# Altium schematic sheet 03-Ethernet.SchDoc: Ethernet Connection
size A4; Engineer: Juan M Garin; Organization: ESO; Address1: Juan M Garin; DocumentNumber: 3; Revision: 1.0; SheetNumber: 3; SheetTotal: 6
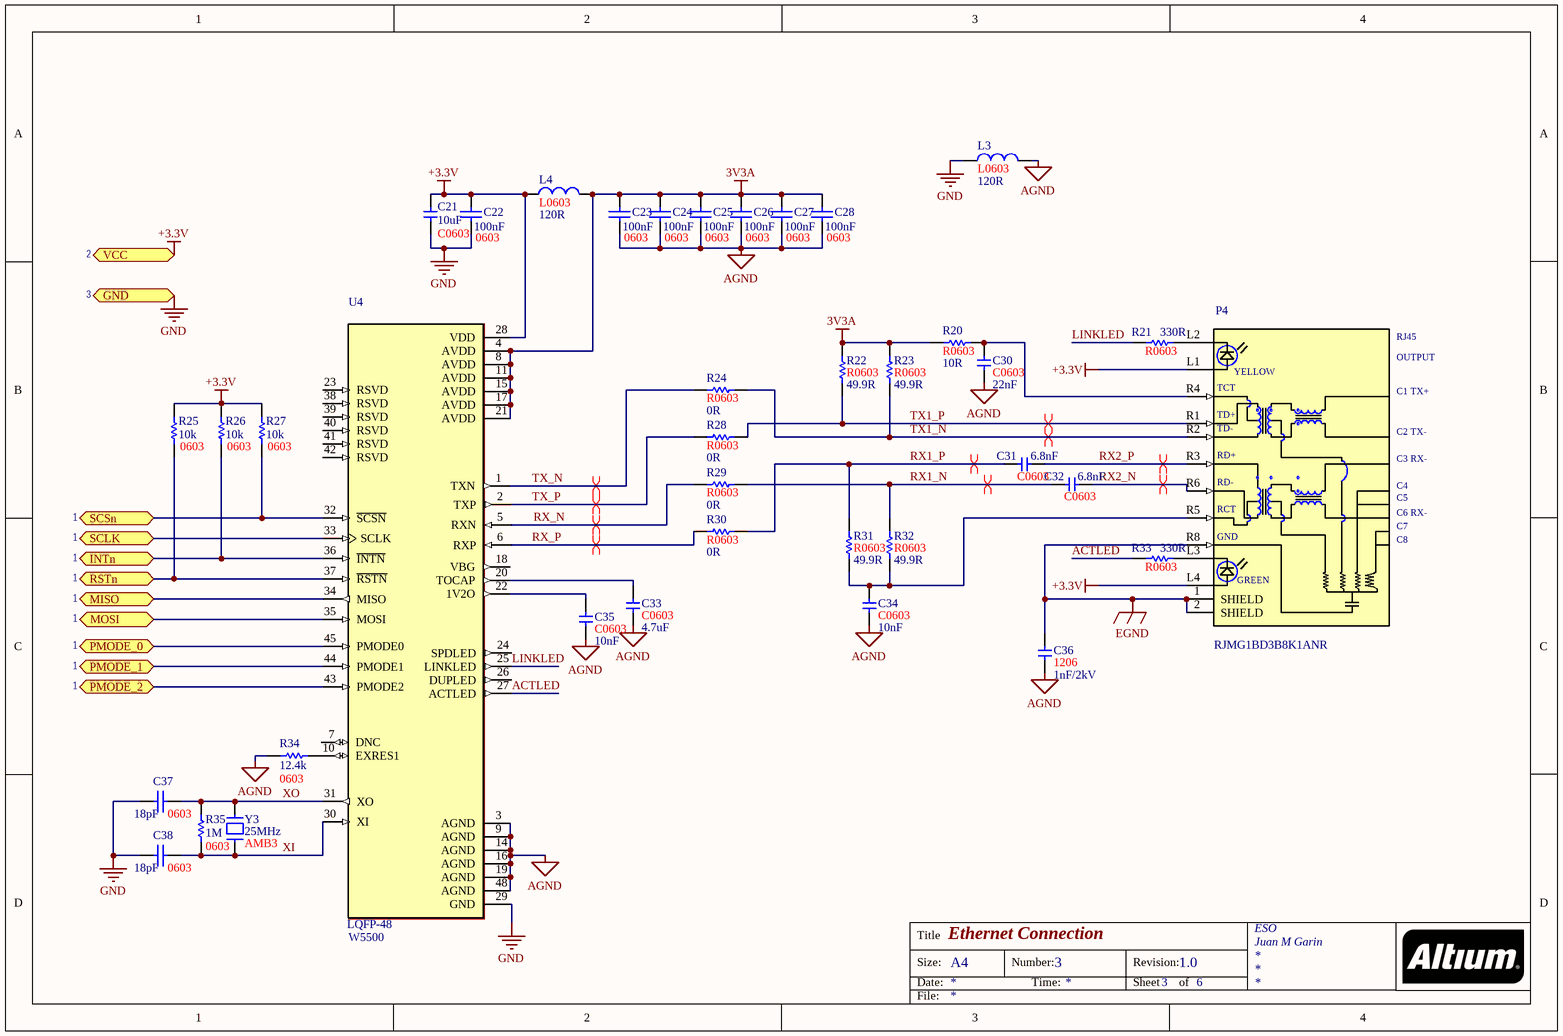
[diagram p0: 03-Ethernet.SchDoc]

## Parts
C21  10uF  [C0603]
C22  100nF  PackageReference: 0603  [C0603]
C23  100nF  PackageReference: 0603  [C0603]
C24  100nF  PackageReference: 0603  [C0603]
C25  100nF  PackageReference: 0603  [C0603]
C26  100nF  PackageReference: 0603  [C0603]
C27  100nF  PackageReference: 0603  [C0603]
C28  100nF  PackageReference: 0603  [C0603]
C30  22nF  [C0603]
C31  6.8nF  [C0603]
C32  6.8nF  [C0603]
C33  4.7uF  [C0603]
C34  10nF  [C0603]
C35  10nF  [C0603]
C36  PackageReference: 1206  [R1206]  (hidden comment: 1nF/2kV)
C37  18pF  PackageReference: 0603  [C0603]
C38  18pF  PackageReference: 0603  [C0603]
L3  120R  [L0603]
L4  120R  [L0603]
P4  RJMG1BD3B8K1ANR  [CONN_RJMG1BD3B8K1ANR_RJMG1BD3B8K1ANR(Primary)]
R20  10R  [R0603]
R21  330R  [R0603]
R22  49.9R  [R0603]
R23  49.9R  [R0603]
R24  0R  [R0603]
R25  10k  PackageReference: 0603  [R0603]
R26  10k  PackageReference: 0603  [R0603]
R27  10k  PackageReference: 0603  [R0603]
R28  0R  [R0603]
R29  0R  [R0603]
R30  0R  [R0603]
R31  49.9R  [R0603]
R32  49.9R  [R0603]
R33  330R  [R0603]
R34  12.4k  PackageReference: 0603  [R0603]
R35  1M  PackageReference: 0603  [R0603]
U4  W5500  PackageReference: LQFP-48  [QFP50P700X700X160-48N]
Y3  25MHz  PackageReference: AMB3  [CRYSTAL-AMB3_5X3.2_1.3]

## Ports
GND, INTn, MISO, MOSI, PMODE_0, PMODE_1, PMODE_2, RSTn, SCLK, SCSn, VCC

## Nets
3V3A: C23.2 C24.2 C25.2 C26.2 C27.2 C28.2 L4.2 R20.1 R22.1 R23.1 U4.4(AVDD) U4.8(AVDD) U4.11(AVDD) U4.15(AVDD) U4.17(AVDD) U4.21(AVDD)
+3.3V: C21.2 C22.2 L4.1 P4.L1 P4.L4 R25.1 R26.1 R27.1 U4.28(VDD) ; port VCC
AGND: C23.1 C24.1 C25.1 C26.1 C27.1 C28.1 C30.1 C33.1 C34.1 C35.1 C36.1 L3.2 R34.1 U4.3(AGND) U4.9(AGND) U4.14(AGND) U4.16(AGND) U4.19(AGND) U4.48(AGND)
EGND: C36.2 P4.1(SHIELD) P4.2(SHIELD) P4.R8(GND)
GND: C21.1 C22.1 C37.2 C38.2 L3.1 U4.29(GND) ; port GND
ACTLED: R33.1 U4.27(ACTLED)
INTn: R26.2 U4.36(~{INTN}) ; port INTn
LINKLED: R21.1 U4.25(LINKLED)
MISO: U4.34(MISO) ; port MISO
MOSI: U4.35(MOSI) ; port MOSI
PMODE_0: U4.45(PMODE0) ; port PMODE_0
PMODE_1: U4.44(PMODE1) ; port PMODE_1
PMODE_2: U4.43(PMODE2) ; port PMODE_2
RSTn: R25.2 U4.37(~{RSTN}) ; port RSTn
RX1_N: C32.2 R29.2 R32.1
RX1_P: C31.2 R30.2 R31.1
RX2_N: C32.1 P4.R6(RD-)
RX2_P: C31.1 P4.R3(RD+)
RX_N: R29.1 U4.5(RXN)
RX_P: R30.1 U4.6(RXP)
SCLK: U4.33(SCLK) ; port SCLK
SCSn: R27.2 U4.32(~{SCSN}) ; port SCSn
TX1_N: P4.R2(TD-) R23.2 R24.2
TX1_P: P4.R1(TD+) R22.2 R28.2
TX_N: R24.1 U4.1(TXN)
TX_P: R28.1 U4.2(TXP)
XI: C38.1 R35.1 U4.30(XI) Y3.1
XO: C37.1 R35.2 U4.31(XO) Y3.2
NetC30_2: C30.2 P4.R4(TCT) R20.2
NetC33_2: C33.2 U4.20(TOCAP)
NetC34_2: C34.2 P4.R5(RCT) R31.2 R32.2
NetC35_2: C35.2 U4.22(1V2O)
NetP4_L2: P4.L2 R21.2
NetP4_L3: P4.L3 R33.2
NetR34_2: R34.2 U4.10(EXRES1)

Not connected (* = marked no-connect by the designer): U4 7(DNC) 18(VBG) 23(RSVD) 24(SPDLED) 26(DUPLED) 38(RSVD) 39(RSVD) 40(RSVD) 41(RSVD) 42(RSVD)

## Layout directives
differential pair: RX1_N, RX1_P, RX2_N, RX2_P, RX_N, RX_P, TX1_N, TX1_P, TX_N, TX_P

## Notes on the sheet
- 2
- 3
- 1
- Title
- Size:
- Date:
- A4
- Number:
- Time:
- Revision:
- Sheet
- of
- File:
- (in symbol RJMG1BD3B8K1ANR) RJ45; OUTPUT; YELLOW; C1 TX+; C2 TX-; C3 RX-; C4; C5; C6 RX-; C7; C8; GREEN

## Library data of the parts
C21 = Cap_0603: Capacitor; Manufacturer Part Number: JMK107ABJ106MA-T; PackageReference: C0603; Value: 10uF
C22-C28 = Cap Semi: Capacitor (Semiconductor SIM Model); Manufacturer Part Number: CL10F104ZO8NNNC; Value: 100nF
C30 = Cap_0402: Capacitor; Manufacturer Part Number: CL10B223KA8NNWC; PackageReference: C0603; Value: 22nF
C31 C32 = Cap_0402: Capacitor; Manufacturer Part Number: CL10B682KB8SFNC; PackageReference: C0603; Value: 6.8nF
C33 = Cap_0402: Capacitor; Manufacturer Part Number: CL10A475MP5LNNC; PackageReference: C0603; Value: 4.7uF
C34 C35 = Cap_0402: Capacitor; Manufacturer Part Number: VJ0603Y103KXQCW1BC; PackageReference: C0603; Value: 10nF
C36 = Cap_1206: Capacitor; Manufacturer Part Number: C1206C102KGRACAUTO; Value: 1nF/2kV
C37 C38 = Cap Semi: Capacitor (Semiconductor SIM Model); Manufacturer Part Number: VJ0603A180JXACW1BC; Value: 18pF
L3 L4 = Inductor_0603: Inductor; Manufacturer Part Number: BLM18PG121SN1D; PackageReference: L0603; Value: 120R
P4 = RJMG1BD3B8K1ANR: Accessory RJ-45 With Transformer Connector - UDE; Manufacturer Part Number: RJMG1BD3B8K1ANR; Package: RJ45 with MAGNETICS; Value: *
R20 = Res_0402: Resistor; Manufacturer Part Number: RMCF0603JT10R0; PackageReference: R0603; Value: 10R
R21 R33 = Res_0402: Resistor; Manufacturer Part Number: RMCF0603JT330R; PackageReference: R0603; Value: 330R
R22 R23 R31 R32 = Res_0402: Resistor; Manufacturer Part Number: RMCF0603FT49R9; PackageReference: R0603; Value: 49.9R
R24 R28-R30 = Res_0402: Resistor; Manufacturer Part Number: CR0603-J/-000ELF; PackageReference: R0603; Value: 0R
R25-R27 = Res1: Resistor; Manufacturer Part Number: RMCF0603FT10K0; Value: 10k
R34 = Res1: Resistor; Manufacturer Part Number: RMCF0603FT12K4; Value: 12.4k
R35 = Res1: Resistor; Manufacturer Part Number: RMCF0603FG1M00; Value: 1M
U4 = W5500: Victor Pure White Collection Wood Tidy Tower Organizer; Package: LQFP-48 Victor Technologies; Manufacturer Part Number: W5500
Y3 = CRYSTAL: Manufacturer Part Number: ABM3-25.000MHZ-D2Y-T